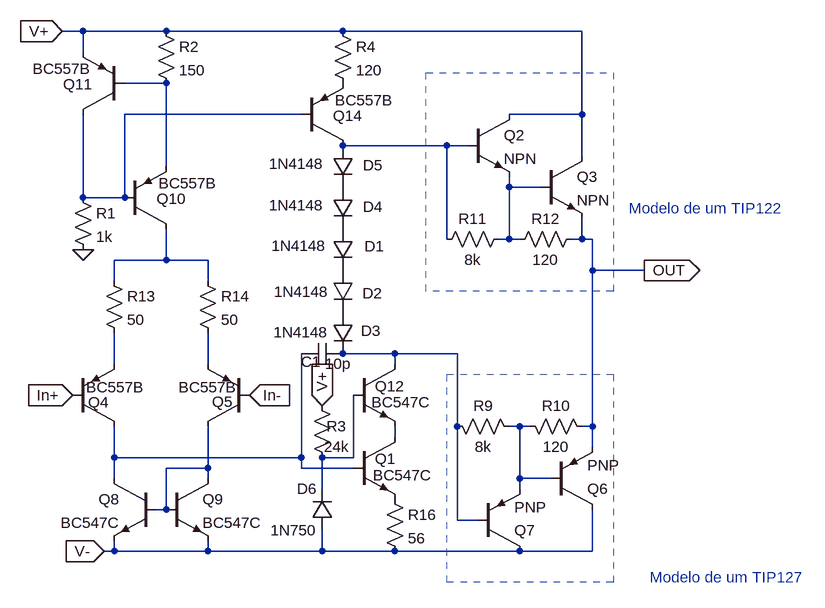
[diagram p0: schematic H_Cascode.asc]
H_Cascode.asc, the LTspice schematic file:
Version 4.1
SHEET 1 1376 680
WIRE -80 -416 -112 -416
WIRE 48 -416 -80 -416
WIRE 320 -416 48 -416
WIRE 688 -416 320 -416
WIRE -80 -384 -80 -416
WIRE 48 -336 -16 -336
WIRE 256 -288 -16 -288
WIRE 688 -288 688 -416
WIRE 688 -288 576 -288
WIRE 480 -240 320 -240
WIRE 512 -240 480 -240
WIRE 688 -224 688 -288
WIRE 48 -208 48 -336
WIRE 576 -176 576 -192
WIRE 624 -176 576 -176
WIRE -80 -160 -80 -288
WIRE -16 -160 -16 -288
WIRE -16 -160 -80 -160
WIRE 480 -96 480 -240
WIRE 576 -96 576 -176
WIRE 576 -96 560 -96
WIRE 592 -96 576 -96
WIRE 688 -96 688 -128
WIRE 688 -96 672 -96
WIRE 704 -96 688 -96
WIRE 48 -64 48 -112
WIRE 48 -64 -32 -64
WIRE 112 -64 48 -64
WIRE 704 -48 704 -96
WIRE 784 -48 704 -48
WIRE -32 -32 -32 -64
WIRE 112 -32 112 -64
WIRE 400 80 320 80
WIRE 496 80 400 80
WIRE -32 96 -32 48
WIRE 112 96 112 48
WIRE 400 96 400 80
WIRE 496 192 496 80
WIRE 592 192 576 192
WIRE 608 192 592 192
WIRE 704 192 704 -48
WIRE 704 192 688 192
WIRE 400 208 400 192
WIRE 704 224 704 192
WIRE -32 240 -32 192
WIRE 256 240 256 80
WIRE 256 240 -32 240
WIRE 336 240 336 144
WIRE 336 240 288 240
WIRE 112 256 112 192
WIRE 112 256 48 256
WIRE 256 256 256 240
WIRE 336 256 256 256
WIRE -32 272 -32 240
WIRE 112 272 112 256
WIRE 592 272 592 192
WIRE 640 272 592 272
WIRE 288 288 288 240
WIRE 592 288 592 272
WIRE 48 320 48 256
WIRE 48 320 32 320
WIRE 496 336 496 192
WIRE 528 336 496 336
WIRE -32 384 -32 368
WIRE -32 384 -48 384
WIRE 112 384 112 368
WIRE 112 384 -32 384
WIRE 288 384 288 352
WIRE 288 384 112 384
WIRE 400 384 288 384
WIRE 592 384 400 384
WIRE 704 384 704 320
WIRE 704 384 592 384
FLAG -112 -416 V+
IOPIN -112 -416 In
FLAG -48 384 V-
IOPIN -48 384 In
FLAG -96 144 In+
IOPIN -96 144 In
FLAG 176 144 In-
IOPIN 176 144 In
FLAG 784 -48 OUT
IOPIN 784 -48 Out
FLAG -80 -80 0
FLAG 288 160 V+
IOPIN 288 160 In
SYMBOL pnp -96 192 M180
WINDOW 3 21 60 Left 2
WINDOW 0 24 37 Left 2
SYMATTR Value BC557B
SYMATTR InstName Q4
SYMBOL pnp 176 192 R180
WINDOW 3 20 60 Left 2
WINDOW 0 25 38 Left 2
SYMATTR Value BC557B
SYMATTR InstName Q5
SYMBOL res 304 -432 R0
SYMATTR InstName R4
SYMATTR Value 120
SYMBOL res 480 176 M90
WINDOW 0 0 56 VBottom 2
WINDOW 3 32 56 VTop 2
SYMATTR InstName R9
SYMATTR Value 8k
SYMBOL res 592 176 M90
WINDOW 0 0 56 VBottom 2
WINDOW 3 32 56 VTop 2
SYMATTR InstName R10
SYMATTR Value 120
SYMBOL npn 512 -288 R0
SYMATTR InstName Q2
SYMBOL npn 624 -224 R0
SYMATTR InstName Q3
SYMBOL res 464 -80 R270
WINDOW 0 32 56 VTop 2
WINDOW 3 0 56 VBottom 2
SYMATTR InstName R11
SYMATTR Value 8k
SYMBOL res 576 -80 R270
WINDOW 0 32 56 VTop 2
WINDOW 3 0 56 VBottom 2
SYMATTR InstName R12
SYMATTR Value 120
SYMBOL pnp 640 320 M180
SYMATTR InstName Q6
SYMBOL pnp 528 384 M180
SYMATTR InstName Q7
SYMBOL npn 336 208 R0
WINDOW 0 33 34 Left 2
WINDOW 3 30 59 Left 2
SYMATTR InstName Q1
SYMATTR Value BC547C
SYMBOL cap 320 64 R90
WINDOW 0 44 49 VBottom 2
WINDOW 3 16 7 VTop 2
SYMATTR InstName C1
SYMATTR Value 10p
SYMBOL diode 304 -112 R0
WINDOW 0 49 27 Left 2
WINDOW 3 -94 26 Left 2
SYMATTR InstName D1
SYMATTR Value 1N4148
SYMBOL diode 304 -48 R0
WINDOW 0 46 35 Left 2
WINDOW 3 -90 33 Left 2
SYMATTR InstName D2
SYMATTR Value 1N4148
SYMBOL diode 304 16 R0
WINDOW 0 44 29 Left 2
WINDOW 3 -91 31 Left 2
SYMATTR InstName D3
SYMATTR Value 1N4148
SYMBOL diode 304 -176 R0
WINDOW 0 47 30 Left 2
WINDOW 3 -98 28 Left 2
SYMATTR InstName D4
SYMATTR Value 1N4148
SYMBOL diode 304 -240 R0
WINDOW 0 47 30 Left 2
WINDOW 3 -98 28 Left 2
SYMATTR InstName D5
SYMATTR Value 1N4148
SYMBOL res -48 -48 R0
SYMATTR InstName R13
SYMATTR Value 50
SYMBOL res 96 -48 R0
SYMATTR InstName R14
SYMATTR Value 50
SYMBOL res 384 288 R0
SYMATTR InstName R16
SYMATTR Value 56
SYMBOL npn 32 272 M0
SYMATTR InstName Q8
SYMATTR Value BC547C
SYMBOL npn 48 272 R0
SYMATTR InstName Q9
SYMATTR Value BC547C
SYMBOL res -96 -176 R0
SYMATTR InstName R1
SYMATTR Value 1k
SYMBOL pnp -16 -112 M180
WINDOW 3 52 70 Left 2
WINDOW 0 49 46 Left 2
SYMATTR Value BC557B
SYMATTR InstName Q10
SYMBOL res 32 -432 R0
SYMATTR InstName R2
SYMATTR Value 150
SYMBOL pnp -16 -288 R180
WINDOW 3 52 70 Left 2
WINDOW 0 49 46 Left 2
SYMATTR Value BC557B
SYMATTR InstName Q11
SYMBOL pnp 256 -240 M180
WINDOW 3 52 70 Left 2
WINDOW 0 49 46 Left 2
SYMATTR Value BC557B
SYMATTR InstName Q14
SYMBOL npn 336 96 R0
WINDOW 0 33 34 Left 2
WINDOW 3 28 59 Left 2
SYMATTR InstName Q12
SYMATTR Value BC547C
SYMBOL diode 304 352 R180
WINDOW 0 24 64 Left 2
WINDOW 3 24 0 Left 2
SYMATTR InstName D6
SYMATTR Value 1N750
SYMBOL res 272 144 R0
WINDOW 0 23 48 Left 2
WINDOW 3 19 79 Left 2
SYMATTR InstName R3
SYMATTR Value 24k
TEXT 760 -144 Left 2 ;Modelo de um TIP122
TEXT 792 424 Left 2 ;Modelo de um TIP127
RECTANGLE Normal 736 -16 448 -352 2
RECTANGLE Normal 736 432 480 112 2

The netlist it stands for:
* H_Cascode.asc
Q4 N011 In+ N007 0 BC557B
Q5 N013 In- N008 0 BC557B
R4 V+ P001 120
R9 N006 N009 8k
R10 N009 OUT 120
Q2 V+ N003 N004 0 NPN
Q3 V+ N004 OUT 0 NPN
R11 N003 N004 8k
R12 N004 OUT 120
Q6 V- N009 OUT 0 PNP
Q7 V- N006 N009 0 PNP
Q1 N010 N011 P002 0 BC547C
C1 N006 N011 10p
D1 P003 P004 1N4148
D2 P004 P005 1N4148
D3 P005 N006 1N4148
D4 P006 P003 1N4148
D5 N003 P006 1N4148
R13 N005 N007 50
R14 N005 N008 50
R16 P002 V- 56
Q8 N011 N013 V- 0 BC547C
Q9 N013 N013 V- 0 BC547C
R1 N002 0 1k
Q10 N005 N002 N001 0 BC557B
R2 V+ N001 150
Q11 N002 N001 V+ 0 BC557B
Q14 N003 N002 P001 0 BC557B
Q12 N006 N012 N010 0 BC547C
D6 V- N012 1N750
R3 V+ N012 24k
.model D D
.lib standard.dio
.model NPN NPN
.model PNP PNP
.lib standard.bjt
* Modelo de um TIP122
* Modelo de um TIP127
.backanno
.end